# EAGLE design main (EAGLE 9.6.2)
CNAME: ZDS Shifter Pro; CREVISION: F; DESIGNER: Darin Kadrioski
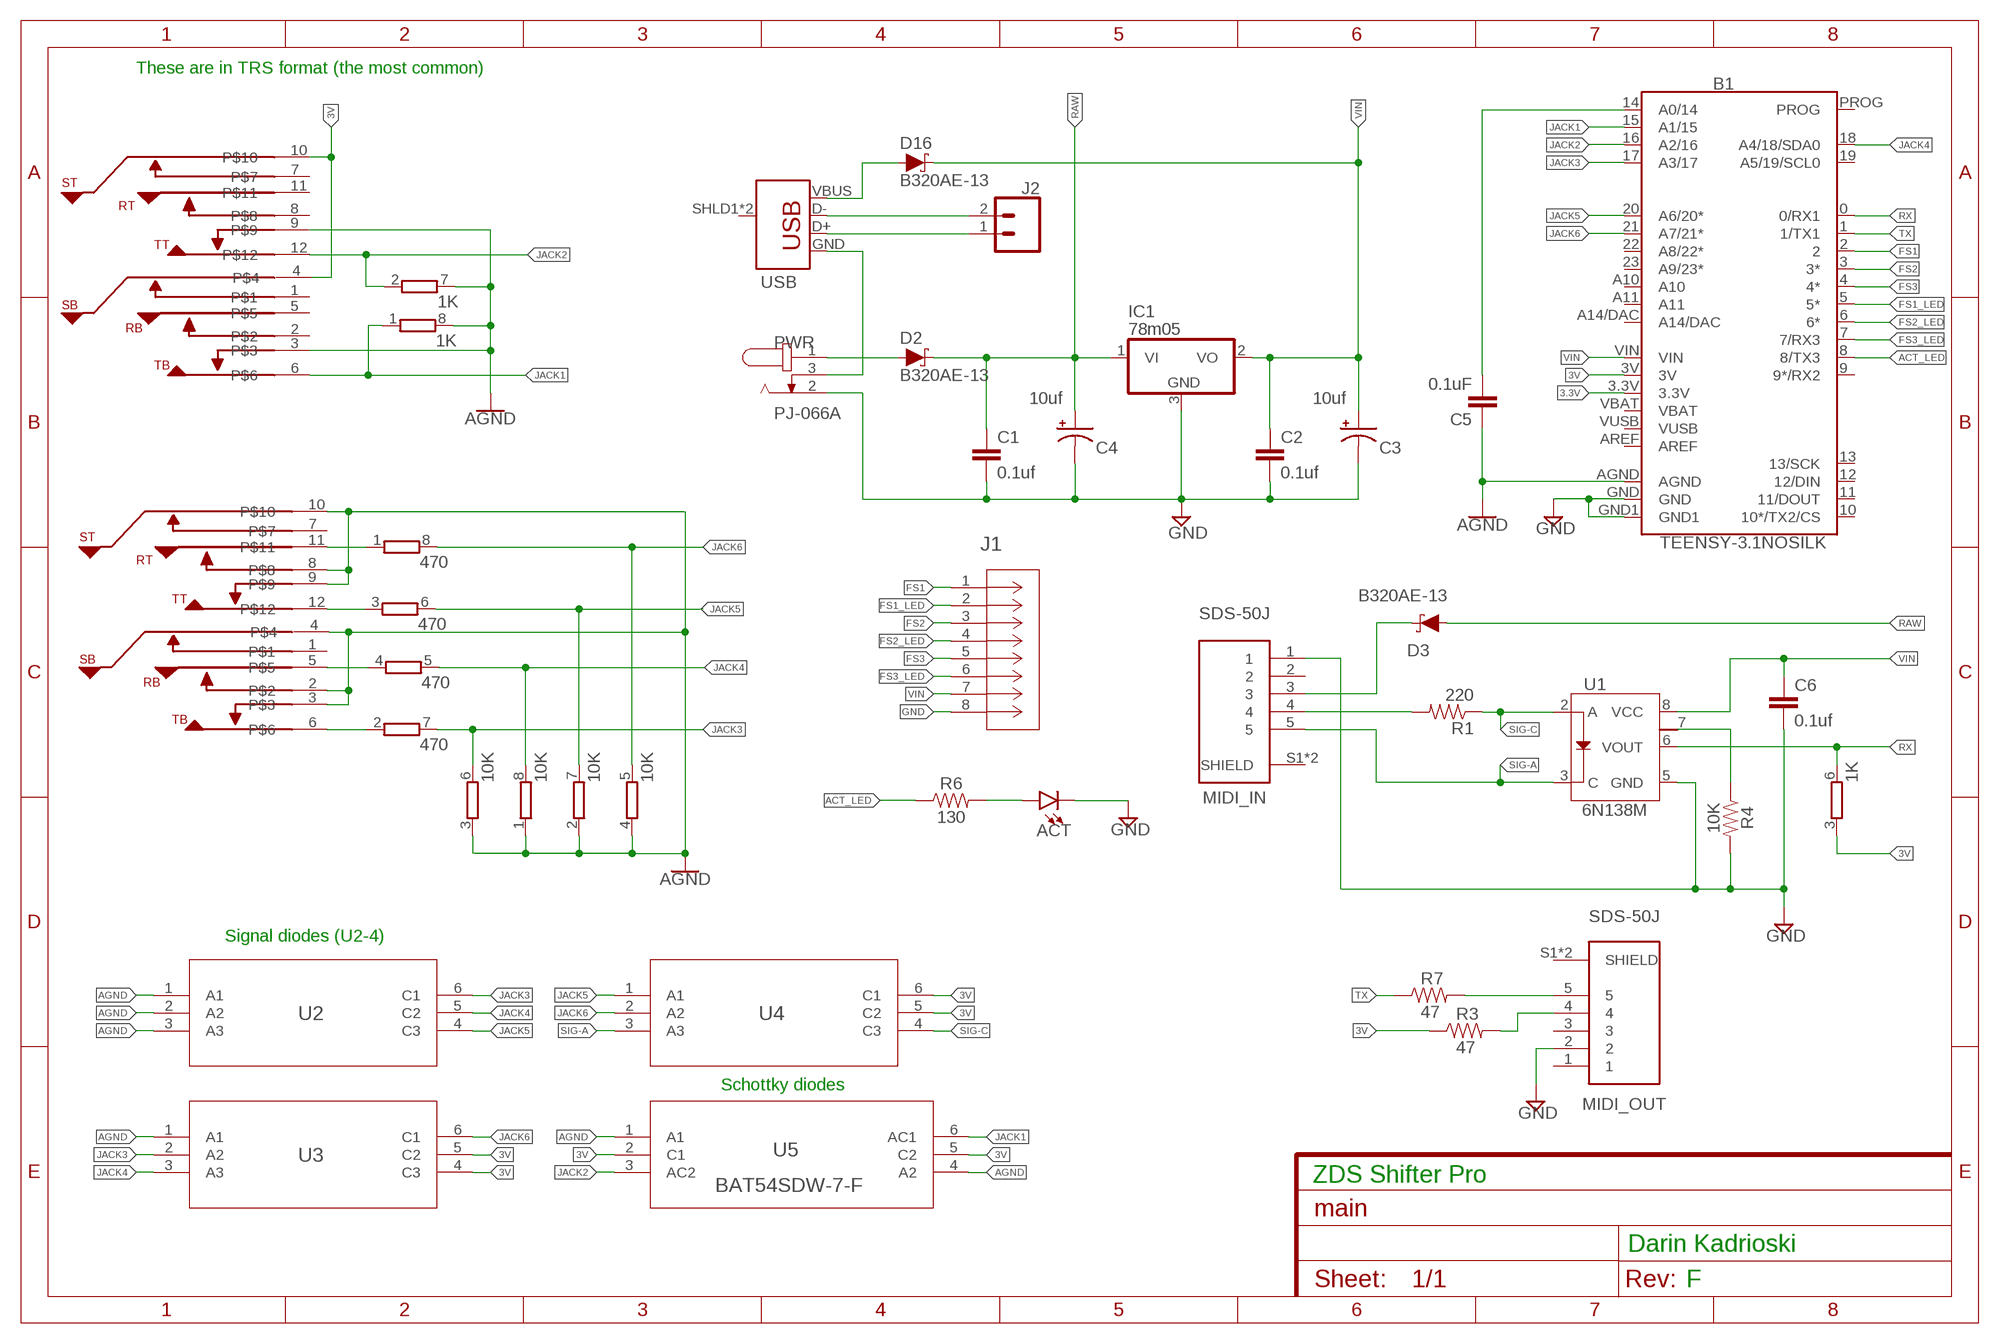
[diagram p0: schematic, sheet 1]

## Parts
ACT  LED3MM  [LED_3MM]
B1  TEENSY-3.1NOSILK  [TEENSY-3.1_NOSILK]
C1  0.1uf  C-EUC1206  [C1206]
C2  0.1uf  C-EUC1206  [C1206]
C3  10uf  47UF-POLAR-PANASONIC_D-35V-20%  [PANASONIC_D]
C4  10uf  47UF-POLAR-PANASONIC_D-35V-20%  [PANASONIC_D]
C5  0.1uF  C-EUC1206  [C1206]
C6  0.1uf  C-EUC1206  [C1206]
D2  B320AE-13  DIODE-SCHOTTKY-SS14  [SMA-DIODE]
D3  B320AE-13  DIODE-SCHOTTKY-SS14  [SMA-DIODE]
D16  B320AE-13  DIODE-SCHOTTKY-SS14  [SMA-DIODE]
EXP  EXP  ACJS-MHDCM  [MHD]
IC1  78m05  7805DT  [TO252]
J1  188275-8  [CONN_188275-8_TYC]
J2  CONN_02  [1X02]
MIDI_IN  SDS-50J  [CUI_SDS-50J]
MIDI_OUT  SDS-50J  [CUI_SDS-50J]
PWR  PJ-066A  [CUI_PJ-066A]
R1  220  RESISTOR1206  [1206]
R3  47  RESISTOR1206  [1206]
R4  10K  RESISTOR1206  [1206]
R6  130  RESISTOR1206  [1206]
R7  47  RESISTOR1206  [1206]
RN1  470  4R-NEXB38V  [EXB38V]
RN2  10K  4R-NEXB38V  [EXB38V]
RN3  1K  4R-NEXB38V  [EXB38V]
TRIG1  TRIG  ACJS-MHDCM  [MHD]
U1  6N138M  OPTO_DARL_6N138S  [8-SMD]
U2  MMBD4148TW-7-F  [SOT-363_DIO]
U3  MMBD4148TW-7-F  [SOT-363_DIO]
U4  MMBD4148TW-7-F  [SOT-363_DIO]
U5  BAT54SDW-7-F  [SOT-363_DIO]
USB  USB_B_PTH  [USB-B-PTH]

## Nets
3.3V: B1.3.3V
3V [VCC]: B1.3V EXP.4 EXP.10 R3.1 RN3.3 U3.4(C3) U3.5(C2) U4.5(C2) U4.6(C1) U5.2(C1) U5.5(C2)
ACT_LED: B1.8(8/TX3) R6.1
AGND: B1.AGND C5.1 EXP.3 EXP.9 RN2.1 RN2.2 RN2.3 RN2.4 RN3.7 RN3.8 TRIG1.2 TRIG1.3 TRIG1.4 TRIG1.8 TRIG1.9 TRIG1.10 U2.1(A1) U2.2(A2) U2.3(A3) U3.1(A1) U5.1(A1) U5.4(A2)
FS1: B1.2 J1.1
FS1_LED: B1.5(5*) J1.2
FS2: B1.3(3*) J1.3
FS2_LED: B1.6(6*) J1.4
FS3: B1.4(4*) J1.5
FS3_LED: B1.7(7/RX3) J1.6
GND [GND]: ACT.K(C) B1.GND B1.GND1 C1.2 C2.2 C3.- C4.- C6.2 IC1.3(GND) J1.8 MIDI_IN.1 MIDI_OUT.2 PWR.2 R4.2 U1.5(GND)
J3-TIP: RN1.2 TRIG1.6
J4-RING: RN1.4 TRIG1.5
J5-TIP: RN1.3 TRIG1.12
J6-RING: RN1.1 TRIG1.11
JACK1: B1.15(A1/15) EXP.6 RN3.1 U5.6(AC1)
JACK2: B1.16(A2/16) EXP.12 RN3.2 U5.3(AC2)
JACK3: B1.17(A3/17) RN1.7 RN2.6 U2.6(C1) U3.2(A2)
JACK4: B1.18(A4/18/SDA0) RN1.5 RN2.8 U2.5(C2) U3.3(A3)
JACK5: B1.20(A6/20*) RN1.6 RN2.7 U2.4(C3) U4.1(A1)
JACK6: B1.21(A7/21*) RN1.8 RN2.5 U3.6(C1) U4.2(A2)
N$1: ACT.A R6.2
N$3: MIDI_IN.4 R1.2
N$4: B1.14(A0/14) C5.2
N$5 [RAW]: D3.C MIDI_IN.3
N$6: MIDI_OUT.4 R3.2
N$7 [RAW]: D2.A PWR.1
N$8: MIDI_OUT.5 R7.2
N$10: J2.1 USB.D+
N$11: R4.1 U1.7
N$13: J2.2 USB.D-
N$15: PWR.3 USB.GND
N$17: D16.A USB.VBUS
RAW [RAW]: C1.1 C4.+ D2.C D3.A IC1.1(VI)
RX: B1.0(0/RX1) RN3.6 U1.6(VOUT)
SIG-A: MIDI_IN.5 U1.3(C) U4.3(A3)
SIG-C: R1.1 U1.2(A) U4.4(C3)
TX: B1.1(1/TX1) R7.1
VIN: B1.VIN C2.1 C3.+ C6.1 D16.C IC1.2(VO) J1.7 U1.8(VCC)
Unconnected: B1.9(9*/RX2) B1.10(10*/TX2/CS) B1.11(11/DOUT) B1.12(12/DIN) B1.13(13/SCK) B1.19(A5/19/SCL0) B1.22(A8/22*) B1.23(A9/23*) B1.A10 B1.A11 B1.A14/DAC B1.AREF B1.PROG EXP.1 EXP.2 EXP.5 EXP.7 EXP.8 EXP.11 MIDI_IN.2 MIDI_IN.S1(SHIELD) MIDI_IN.S2(SHIELD) MIDI_OUT.1 MIDI_OUT.3 MIDI_OUT.S1(SHIELD) MIDI_OUT.S2(SHIELD) RN3.4 RN3.5 TRIG1.1 TRIG1.7 USB.SHLD1(SHIELD) USB.SHLD2(SHIELD)

## Notes on the sheet
- These are in TRS format (the most common)
- Signal diodes (U2-4)
- Schottky diodes

## Power pins joined to a net without a drawn wire
VBAT: B1.VBAT
VUSB: B1.VUSB

## Library data of the parts
ACT = SparkFun-LED:LED: LED (Generic) Standard schematic elements and footprints for 5mm, 3mm, 1206, and 0603 sized LEDs. Generic LEDs with no color specified.; PROD_ID: DIO-08794
B1 = SparkFun-Boards:TEENSY-3.1: Teensy 3+ Footprint Mechanical footprint with connectors for Teensy Development Board with ARM Cortex. SparkFun Products: Teensy 3.2 <https://www.sparkfun.com/products/13736> Teensy LC <https://www.sparkfun.com/products/13305>; SF_ID: DEV-12646
C1 C2 C5 C6 = resistor:C-EU: CAPACITOR, European symbol
C3 C4 = SparkFun-Capacitors:47UF-POLAR: 47µF polarized capacitors A capacitor is a passive two-terminal electrical component used to store electrical energy temporarily in an electric field.; PROD_ID: CAP-08478; VALUE: 47uF
D2 D3 D16 = SparkFun-DiscreteSemi:DIODE-SCHOTTKY: Schottky diode A Schottky diode is a semiconductor diode which has a low forward voltage drop and a very fast switching action.; PROD_ID: DIO-08053; VALUE: 1A/40V/500mV
EXP TRIG1 = ACJS-MHDCM:ACJS-MHDCM: Check prices <https://pricing.snapeda.com/search/part/ACJS-MHDCM/?ref=eda>; AVAILABILITY: Warning; DESCRIPTION: 6.35mm (0.250, 1/4) - Headphone Phone Jack, Dual Stereo (3 Conductor, TRS) Connector Press-Fit, Solder; MF: Amphenol; MP: ACJS-MHDCM; PACKAGE: None; PRICE: None; PURCHASE-URL: https://pricing.snapeda.com/search/part/ACJS-MHDCM/?ref=eda
IC1 = linear:78*: Positive VOLTAGE REGULATOR Source: http://cache.national.com/ds/LM/LM78L05.pdf http://www.fairchildsemi.com/ds/LM/LM7805.pdf
J1 = ul_1882758:188275-8; BUILT_BY: EMA_UL_Team; COPYRIGHT: Copyright (C) 2016 Accelerated Designs. All rights reserved; MANUFACTURER_PART_NUMBER: 188275-8; SOURCELIBRARY: Tyco_2012-06-25; VENDOR: TE Connectivity
J2 = SparkFun-Connectors:CONN_02: Multi connection point. Often used as Generic Header-pin footprint for 0.1 inch spaced/style header connections On any of the 0.1 inch spaced packages, you can populate with these: Break Away Headers - Straight <https://www.sparkfun.com/products/116> (PRT-00116) Break Away Male Headers - Right Angle <https://www.sparkfun.com/products/553> (PRT-00553) Female Headers <https://www.sparkfun.com/products/115> (PRT-00115) Break Away Headers - Machine Pin <https://www.sparkfun.com/products/117> (PRT-00117) Break Away Female Headers - Swiss Machine Pin <https://www.sparkfun.com/products/743> (PRT-00743) For SCREWTERMINALS and SPRING TERMINALS visit here: Screw Terimnals on SparkFun.com <https://www.sparkfun.com/search/results?term=Screw+Terminals> (5mm/3.5mm/2.54mm spacing) This device is also useful as a general connection point to wire up your design to another part of your project. Our various solder wires solder well into these plated through hole pads. Hook-Up Wire - Assortment (Stranded, 22 AWG) <https://www.sparkfun.com/products/11375> (PRT-11375) Hook-Up Wire - Assortment (Solid Core, 22 AWG) <https://www.sparkfun.com/products/11367> (PRT-11367) View the entire wire category on our website here <https://www.sparkfun.com/categories/141> Special notes: Molex polarized connector foot print use with: PRT-08233 with associated crimp pins and housings. 2.54_SCREWTERM for use with PRT-10571. 3.5mm Screw Terminal footprints for PRT-08084 5mm Screw Terminal footprints for use with PRT-08432
MIDI_IN MIDI_OUT = SDS-50J:SDS-50J: Standard Din Connector 5 Pin, Right-Angle Receptacle, 180° Check prices <https://snapeda.com/parts/SDS-50J/CUI%20Devices/view-part/?ref=eda>; AVAILABILITY: Warning; CUI_PURCHASE_URL: https://www.cuidevices.com/product/interconnect/connectors/din-connectors/sds-j-series?utm_source=snapeda.com&utm_medium=referral&utm_campaign=snapedaBOM; DESCRIPTION: 3~13 Positions, Receptacle, Right Angle, Through Hole, Standard Circular DIN Connector; DIGIKEY-PURCHASE-URL: https://snapeda.com/shop?store=DigiKey&id=422204; MF: CUI Devices; MOUSER-PURCHASE-URL: https://snapeda.com/shop?store=Mouser&id=422204; MP: SDS-50J; PACKAGE: None; PRICE: None
PWR = PJ-066A:PJ-066A: 24 VDC 5 A Right Angle Through Hole 2 Conductors 3 Contacts Male Power Jack; CUI_PURCHASE_URL: https://www.cui.com/product/interconnect/dc-power-connectors/jacks/2.0-mm-center-pin/pj-066a?utm_source=snapeda.com&utm_medium=referral&utm_campaign=snapedaBOM; DESCRIPTION: 24 VDC 5 A Right Angle Through Hole 2 Conductors 3 Contacts Male Power Jack; DIGI-KEY_PART_NUMBER: CP-066A-ND; DIGI-KEY_PURCHASE_URL: https://www.digikey.com/product-detail/en/cui-inc/PJ-066A/CP-066A-ND/2627225?utm_source=snapeda&utm_medium=aggregator&utm_campaign=symbol; MF: CUI Inc.; MP: PJ-066A; PACKAGE: None
R1 R3 R4 R6 R7 = SparkFun-Resistors:RESISTOR: Generic Resistor Package
RN1-RN3 = resistor-dil:4R-N: Array Chip Resistor Source: RS Component / Phycomp; OC_FARNELL: unknown; OC_NEWARK: unknown
U1 = darin-custom:OPTO_DARL_6N138S: Optoisolator, darlington pair output Optocoupler consisting of an AlGaAs LED optically coupled to a high gain split darlington photodetector. SparkFun Products: SparkFun MIDI Shield <https://www.sparkfun.com/products/12898>; PROD_ID: IC-09482
U2-U4 = MMBD4148TW7F:MMBD4148TW-7-F; BUILT_BY: EMA_UL_Team; MANUFACTURER_PART_NUMBER: MMBD4148TW-7-F; SOURCELIBRARY: DIODESINC_2_2015-08-18; VENDOR: Diodes Inc
U5 = BAT54SDW7F:BAT54SDW-7-F; BUILT_BY: EMA_UL_Team; MANUFACTURER_PART_NUMBER: BAT54SDW-7-F; SOURCELIBRARY: DIODESINC_2_2015-08-18; VENDOR: Diodes Inc
USB = SparkFun-Connectors:USB_B: USB Type B Connector SparkFun Products: SparkFun Stepoko <https://www.sparkfun.com/products/13899> PTH; PROD_ID: CONN-08278; SF_ID: PRT-00139

## Net classes
0 default: width 0.254 mm
1 VCC: width 0.254 mm
2 GND: width 0.254 mm
3 RAW: width 0.6 mm

## Board
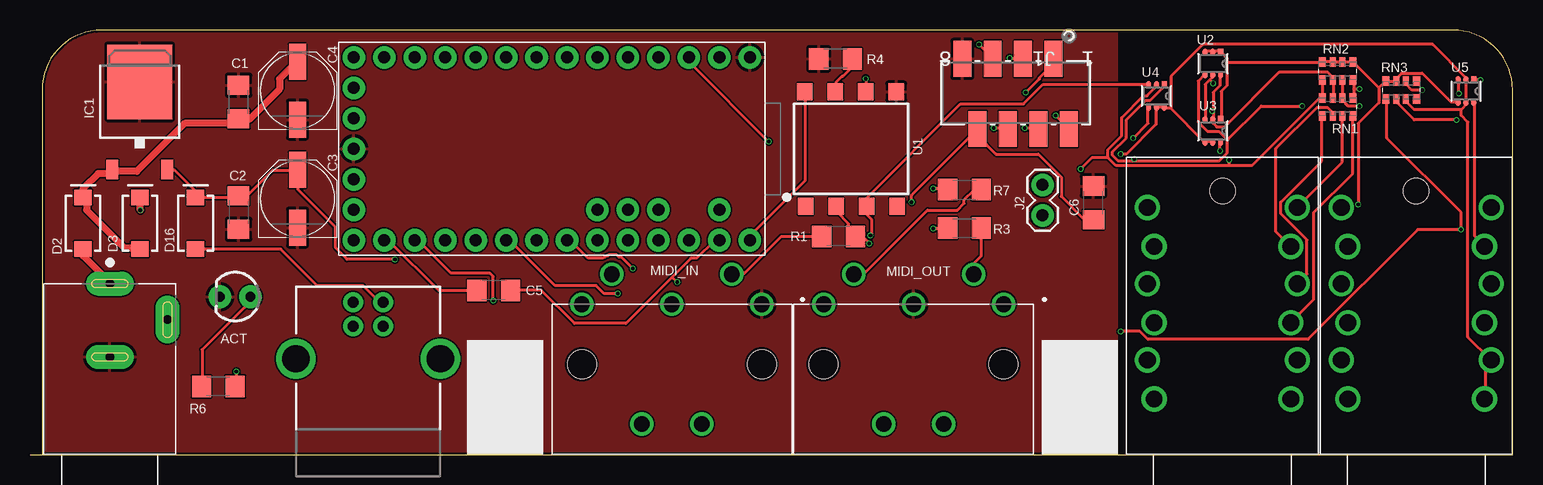
[diagram p1: board, top side]
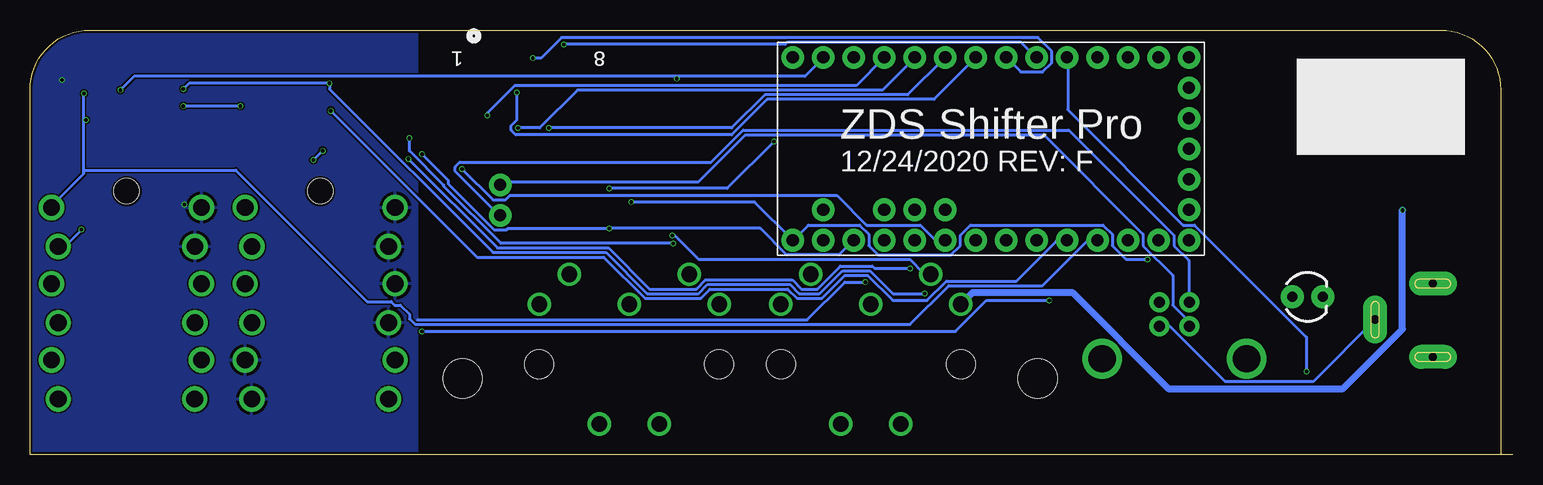
[diagram p2: board, bottom side, seen from below]

Size 123.6 x 35.4 mm. Coordinates in mm from the lower left corner, seen from the top.
Outline: 0,0 1,0
Outline: 1,0 123.6,0 123.6,30.4 arc90 118.6,35.4 6,35.4 arc90 1,30.4 1,0
Copper layers (1*16): Top 0.035559375mm / dielectric 1.6mm / Bottom 0.035559375mm
Design rules "jlcpcb2layer": minimum track width 5mil, minimum drill 12mil, track to track 5mil, track to pad 5mil, pad to pad 5mil, via to via 5mil, smd to smd 5mil, copper to edge 8mil, drill to drill 6mil, minimum pad ring 5mil, minimum via ring 3mil, stop-mask expansion 2.5mil, vias tented up to drill 0mil, thermal gap 10mil
Holes 3.25 mm at 87.53,6.35 39.6,6.35

### Footprints (pad centres in the part's own frame; a part is rotated, then mirrored left to right if it is on the bottom)
LED_3MM = drill 0.813 pad 1.88: A -1.27,0; K 1.27,0
TEENSY-3.1_NOSILK = drill 1.016 pad 1.88: 0 7.62,-13.97; 1 7.62,-11.43; 2 7.62,-8.89; 3 7.62,-6.35; 3.3V 2.54,16.51; 3V -7.62,-11.43; 4 7.62,-3.81; 5 7.62,-1.27; 6 7.62,1.27; 7 7.62,3.81; 8 7.62,6.35; 9 7.62,8.89; 10 7.62,11.43; 11 7.62,13.97; 12 7.62,16.51; 13 -7.62,16.51; 14 -7.62,13.97; 15 -7.62,11.43; 16 -7.62,8.89; 17 -7.62,6.35; 18 -7.62,3.81; 19 -7.62,1.27; 20 -7.62,-1.27; 21 -7.62,-3.81; 22 -7.62,-6.35; 23 -7.62,-8.89; A10 -5.08,-6.35; A11 -5.08,-3.81; A14/DAC -5.08,16.51; AGND -7.62,-13.97; AREF -5.08,-8.89; GND 0,16.51; GND1 7.62,-16.51; PROG -2.54,16.51; VBAT 5.08,16.51; VIN -7.62,-16.51; VUSB -5.08,-13.97
C1206 = smd 1.6 x 1.8: 1 -1.4,0; 2 1.4,0
PANASONIC_D = smd 3 x 1.4: + 2.4,0; - -2.4,0
SMA-DIODE = smd 1.27 x 1.47: A -2.15,0; C 2.15,0
MHD = drill 1.4: 1 3.65,-5.69; 2 -2.7,-5.7; 3 -9.05,-5.7; 4 3.65,5.7; 5 -2.7,5.7; 6 -9.05,5.7; 7 0.4,-6.25; 8 -5.95,-6.25; 9 -12.3,-6.25; 10 0.4,6.25; 11 -5.95,6.25; 12 -12.3,6.25 | hole 2.1: -13.68,0
TO252 = smd 1 x 1.6: 1 -2.28,-4.8; 2 2.28,-4.8 | smd 5.4 x 6.2: 3 0,2.5
CONN_188275-8_TYC = smd 1.499 x 2.997: 1 0,5.85; 2 1.27,0; 3 2.54,5.85; 4 3.81,0; 5 5.08,5.85; 6 6.35,0; 7 7.62,5.85; 8 8.89,0
1X02 = drill 1.016 pad 1.88: 1 0,0; 2 2.54,0
CUI_SDS-50J = drill 1.3: 1 7.5,0; 2 0,0; 3 -7.5,0; 4 5,2.5; 5 -5,2.5; S1 -2.5,-10; S2 2.5,-10 | hole 2.4: -7.5,-5; 7.5,-5
CUI_PJ-066A = drill 0.7 pad 2 long: 1 0,0; 2 6.1,0; 3 3,4.8
1206 = smd 1.6 x 1.8: 1 -1.4,0; 2 1.4,0
EXB38V = smd 0.6 x 0.8: 1 -1.275,-0.75; 4 1.275,-0.75; 5 1.275,0.75; 8 -1.275,0.75 | smd 0.5 x 0.8: 2 -0.4,-0.75; 3 0.4,-0.75; 6 0.4,0.75; 7 -0.4,0.75
8-SMD = smd 1.3 x 1.4: 1 -3.96,-4.96; 2 -1.42,-4.96; 3 1.12,-4.96; 4 3.66,-4.96; 5 3.59,4.58; 6 1.05,4.58; 7 -1.49,4.58; 8 -4.03,4.58
SOT-363_DIO = smd 0.6 x 0.42: 1 -0.95,0.65; 2 -0.95,0; 3 -0.95,-0.65; 4 0.95,-0.65; 5 0.95,0; 6 0.95,0.65
USB-B-PTH = drill 0.914 pad 1.676: D+ 4,1.25; D- 5.981,1.25; GND 4,-1.25; VBUS 5.981,-1.25 | drill 2.286: SHLD1 1.282,-6.02; SHLD2 1.282,6.02

### Placement (x,y rotation side)
ACT  17.1,13.17 180 top
B1  43.5,25.5 90 top
C1  17.38,29.4 90 top
C2  17.38,20.2 270 top
C3  22.3,21.34 90 top
C4  22.3,30.34 90 top
C5  38.65,13.7 180 top
C6  88.65,21 90 top
D2  4.42,19.3 90 top
D3  9.17,19.3 90 top
D16  13.8,19.3 90 top
EXP  115.55,8.3 270 top
IC1  9.15,28.58 0 top
J1  86.6,33 180 top
J2  84.4,22.5 270 top
MIDI_IN  53.5,12.55 0 top
MIDI_OUT  73.65,12.55 0 top
PWR  6.66,14.26 270 top
R1  67.4,18.2 180 top
R3  77.9,18.9 0 top
R4  67.15,33 180 top
R6  15.7,5.69 180 top
R7  77.9,22.1 0 top
RN1  109,29 0 top
RN2  109,32 180 top
RN3  114.3,30.4 0 top
TRIG1  99.4,8.3 270 top
U1  68.62,25.68 0 top
U2  98.6,32.6 270 top
U3  98.6,27 270 top
U4  93.9,29.9 270 top
U5  119.7,30.3 270 top
USB  28.2,6.72 90 top

### Tracks (layer width: path | path; a pad name or v marks a point on that pad's centre or on a via)
3V  (via drill 0.3)
  Top 0.254: v75.3,18.86 76.44,18.86 R3.1 | U3.5 98.54,26.1 97.97,26.1 U3.4 97.87,26.1 95.11,28.86 | 95.11,28.86 94.63,28.86 U4.6 94.53,28.96 93.96,28.96 U4.5 93.87,28.86 93.87,27.53 91.39,25.05 v90.92,25.05 | 119.3,28.77 115.39,28.77 114.73,29.43 114.73,29.62 RN3.3 | 119.3,28.77 119.78,29.24 U5.5 119.68,29.43 119.68,31.24 U5.2 119.78,31.34 116.92,34.2 97.77,34.2 95.11,31.53 95.11,28.86 | 119.3,28.77 119.3,28.29 119.87,27.72 119.87,9.81 121.78,7.91 EXP.10 121.78,7.81 121.3,7.33 121.3,4.67 EXP.4
  Bottom 0.254: B1.3V 55.01,17.81 56.15,16.67 60.53,16.67 62.72,18.86 v75.3,18.86 83.77,18.86 83.87,18.76 84.92,18.76 88.72,22.57 88.72,22.86 v90.92,25.05
ACT_LED  (via drill 0.3)
  Top 0.254: v17.19,6.95 17.19,5.71 R6.1
  Bottom 0.254: v17.19,6.95 17.19,9.81 26.53,19.14 27.48,19.14 37.1,28.77 37.1,33.05 B1.8
AGND  (via drill 0.3)
  Top 0.254: 53.53,14.81 55.1,16.38 55.58,16.38 57.01,17.81 57.39,17.81 B1.AGND | 53.53,14.81 49.67,10.95 45.39,10.95 42.62,13.72 40.05,13.72 C5.1 | U5.4 119.02,29.43 118.44,29.43 116.06,31.81 114.35,31.81 113.97,31.43 113.97,31.24 RN3.7 113.78,31.15 113.11,31.15 RN3.8 112.44,30.57 | U2.3 97.97,33.62 98.54,33.62 U2.2 98.63,33.62 99.2,33.62 U2.1 99.3,33.53 99.77,33.05 99.77,32.67 | 99.77,32.67 99.77,30.77 99.3,30.29 99.3,28 U3.1 | v120.92,31.24 120.44,31.24 U5.1 | v110.73,20.86 110.73,27.62 112.44,29.34 112.44,30.57 | 112.44,30.57 110.35,32.67 RN2.1 110.25,32.77 109.49,32.77 RN2.2 109.39,32.77 108.73,32.77 RN2.3 108.54,32.77 107.78,32.77 RN2.4 107.68,32.67 99.77,32.67 | v53.96,14.38 53.53,14.81
  Bottom 0.254: v53.96,14.38 55.67,14.38 58.82,11.24 91.3,11.24
  pour Bottom: 91.3,37 124,37 124,-1 91.3,-1
FS1  (via drill 0.3)
  Top 0.254: v85.49,28.29 86.53,27.24 J1.1
  Bottom 0.254: v85.49,28.29 85.49,28.48 83.2,30.77 54.72,30.77 52.44,33.05 B1.2
FS1_LED  (via drill 0.3)
  Top 0.254: v83.01,30.19 84.15,31.34 84.15,31.43 85.3,32.58 85.3,32.96 J1.2
  Bottom 0.254: v83.01,30.19 83.01,27.91 83.49,27.43 83.49,27.05 83.11,26.67 65.1,26.67 62.15,29.62 48.24,29.62 44.81,33.05 B1.5
FS2  (via drill 0.3)
  Top 0.254: v82.92,27.24 84.06,27.24 J1.3
  Bottom 0.254: v82.92,27.24 81.11,27.24 77.96,30.39 52.53,30.39 49.86,33.05 B1.3
FS2_LED  (via drill 0.3)
  Top 0.254: v81.68,33.05 82.72,33.05 J1.4
  Bottom 0.254: v81.68,33.05 81.01,33.05 79.3,34.77 39.58,34.77 38.43,33.62 38.43,32.67 39.2,31.91 41.01,31.91 42.15,33.05 B1.6
FS3  (via drill 0.3)
  Top 0.254: v80.34,27.24 81.49,27.24 J1.5
  Bottom 0.254: v80.34,27.24 65.1,27.24 62.34,30 50.44,30 47.39,33.05 B1.4
FS3_LED  (via drill 0.3)
  Top 0.254: v79.11,34.2 80.25,33.05 J1.6
  Bottom 0.254: v79.11,34.2 60.63,34.2 60.44,34.38 41.01,34.38 39.77,33.15 B1.7
GND
  pour Top: 0,37 90.6,37 90.6,-1 0,-1
J3-TIP
  Top 0.254: RN1.2 108.54,28.29 108.54,28.57 108.16,28.96 107.3,28.96 103.87,25.53 103.87,18.57 105.01,17.43 TRIG1.6
J4-RING
  Top 0.254: RN1.4 110.25,28.19 110.25,23.43 107.01,20.19 107.01,12.95 105.11,11.05 TRIG1.5
J5-TIP
  Top 0.254: RN1.3 109.39,28.19 109.39,24.38 105.68,20.67 TRIG1.12
J6-RING
  Top 0.254: RN1.1 107.68,28.19 107.68,24.48 104.25,21.05 104.25,20.1 106.44,17.91 106.44,15.05 105.68,14.29 TRIG1.11
JACK1  (via drill 0.3)
  Top 0.254: U5.6 120.44,29.34 120.44,18.19 121.21,17.43 EXP.6 | RN3.1 113.11,29.62 113.11,26.38 119.3,20.19 v119.3,18.76 115.68,18.76 106.54,9.62 93.2,9.62 92.53,10.29 v90.92,10.29 | v38.62,12.86 38.62,14.86 38.34,15.14 35.1,15.14 32.43,17.81 32.15,17.81 B1.15
  Bottom 0.254: v119.3,18.76 120.63,17.43 121.21,17.43 EXP.6 | v38.62,12.86 43.86,12.86 46.43,10.29 v90.92,10.29
JACK2  (via drill 0.3)
  Top 0.254: v119.11,30.1 119.11,31.24 U5.3 | v118.92,27.91 115.39,27.91 113.97,29.34 113.97,29.62 RN3.2
  Bottom 0.254: 119.11,23.72 119.11,23.43 121.87,20.67 EXP.12 | 119.11,23.72 119.11,27.91 | 119.11,27.91 v119.11,30.1 | v118.92,27.91 119.11,27.91 | 119.11,23.72 106.44,23.72 95.49,12.76 93.49,12.76 93.2,12.48 92.73,12.48 91.96,11.72 91.96,11.34 91.49,10.86 50.24,10.86 47.01,14.1 39.2,14.1 35.48,17.81 34.62,17.81 B1.16
JACK3  (via drill 0.3)
  Top 0.254: RN1.7 108.63,29.81 108.63,31.24 RN2.6 108.54,31.34 108.54,31.53 108.16,31.91 104.16,31.91 99.58,27.34 98.92,27.34 98.63,27.62 98.63,27.91 U3.2 98.63,28 98.63,28.67 | 98.63,28.67 98.63,30.19 99.2,30.77 99.2,31.62 U2.6 | v98.54,28.67 98.63,28.67
  Bottom 0.254: v98.54,28.67 86.34,16.48 75.77,16.48 72.34,13.05 67.67,13.05 66.91,13.81 60.44,13.81 59.67,13.05 57.58,13.05 55.67,14.95 53.77,14.95 51.67,12.86 48.82,12.86 47.2,14.48 41.39,14.48 38.05,17.81 37.2,17.81 B1.17
JACK4  (via drill 0.3)
  Top 0.254: 110.35,30.48 110.35,31.24 RN2.8 | 110.35,30.48 110.35,29.81 RN1.5 | 98.35,31.24 98.54,31.43 98.54,31.62 U2.5 | 98.35,31.24 97.97,30.86 97.97,28 U3.3 | v110.82,30.48 110.35,30.48 | 98.35,31.24 v98.63,30.96 | v49.01,13.43 47.86,13.43 47.2,14.1 43.77,14.1 40.05,17.81 39.77,17.81 B1.18
  Bottom 0.254: v110.82,30.48 110.35,30.96 v98.63,30.96 98.63,30.48 85.01,16.86 75.58,16.86 72.15,13.43 67.86,13.43 67.1,14.19 60.24,14.19 59.48,13.43 57.77,13.43 55.86,15.34 53.58,15.34 51.67,13.43 v49.01,13.43
JACK5  (via drill 0.3)
  Top 0.254: RN2.7 109.39,29.81 RN1.6 109.39,29.62 109.68,29.34 109.68,29.24 109.87,29.05 v110.82,29.05 | 92.06,24.48 99.11,24.48 99.77,25.15 99.77,26.29 | 92.06,24.48 90.72,24.48 90.25,24.96 90.25,25.24 91.39,26.38 91.39,27.91 93.01,29.53 93.39,29.53 94.53,30.67 94.53,30.77 U4.1 | 99.77,26.29 99.11,26.96 98.16,26.96 97.39,27.72 97.39,31.15 97.87,31.62 U2.4 | v106.06,29.05 102.63,29.05 99.87,26.29 99.77,26.29 | v50.24,15.53 49.29,16.48 49.1,16.48 48.91,16.67 48.24,16.67 48.15,16.57 48.05,16.57 47.96,16.48 47.86,16.48 47.77,16.38 46.53,16.38 45.1,17.81 44.81,17.81 B1.20 | v92.06,24.67 92.06,24.48
  Bottom 0.254: v106.06,29.05 v110.82,29.05 | v50.24,15.53 53.2,15.53 53.39,15.72 56.05,15.72 57.96,13.81 59.29,13.81 60.05,14.57 67.29,14.57 68.06,13.81 71.96,13.81 75.39,17.24 84.63,17.24 v92.06,24.67
JACK6  (via drill 0.3)
  Top 0.254: 89.87,24.77 89.87,25.43 91.01,26.57 91.01,28.1 92.82,29.91 93.11,29.91 93.87,30.67 93.87,30.77 U4.2 | 89.87,24.77 90.53,24.1 99.97,24.1 | 99.97,24.1 101.87,24.1 107.49,29.72 107.68,29.72 RN1.8 107.78,29.81 107.78,31.24 RN2.5 | v99.2,25.34 99.2,26 U3.6 | 99.97,24.1 v99.97,24.57 | v87.58,23.81 88.53,24.77 89.87,24.77
  Bottom 0.254: v99.97,24.57 v99.2,25.34 | v87.58,23.81 85.01,21.24 83.96,21.24 83.58,21.62 56.34,21.62 53.86,19.14 49.39,19.14 48.15,17.91 47.39,17.91 B1.21
N$1
  Top 0.254: R6.2 14.34,5.71 14.34,8.76 18.34,12.76 18.34,13.14 ACT.A
N$3
  Top 0.254: R1.2 65.96,18.19 62.63,18.19 59.58,15.14 59.48,15.14 59.39,15.05 58.53,15.05 MIDI_IN.4
N$4
  Top 0.254: C5.2 37.2,13.72 34.05,13.72 29.96,17.81 29.57,17.81 B1.14
N$5  (via drill 0.3)
  Top 0.6: v9.19,20.38 9.19,21.43 D3.C
  Bottom 0.6: v9.19,20.38 9.19,10.48 14.14,5.52 28.72,5.52 36.72,13.53 45.01,13.53 45.96,12.57 MIDI_IN.3
N$6
  Top 0.254: R3.2 79.3,18.86 79.3,16.57 78.63,15.91 78.63,15.14 MIDI_OUT.4
N$7
  Top 0.6: D2.A 4.43,16.57 6.71,14.29 PWR.1
N$8
  Top 0.254: R7.2 78.72,22.1 77.87,21.24 77.87,20.95 77.3,20.38 74.82,20.38 69.58,15.14 68.72,15.14 MIDI_OUT.5
N$10
  Bottom 0.254: USB.D+ 27,10.76 27,11.14 28.34,12.48 28.34,14.95 30.81,17.43 30.81,18.38 39.1,26.67 63.96,26.67 67.86,22.77 84.15,22.77 84.34,22.57 J2.1
N$11
  Top 0.254: U1.7 67.2,30.29 67.2,31.05 67.67,31.53 67.77,31.53 68.53,32.29 68.53,32.96 R4.1
N$13
  Bottom 0.254: USB.D- 27,12.76 27,16.19 28.24,17.43 28.24,18.29 37.01,27.05 64.15,27.05 66.82,24.38 87.77,24.38 88.15,24 88.15,23.62 84.44,19.91 J2.2
N$15
  Bottom 0.254: USB.GND 29.38,10.67 28.53,10.67 23.95,6.1 16.62,6.1 11.48,11.24 PWR.3
N$17
  Top 0.254: D16.A 13.86,17.14 20.91,17.14 23.95,14.1 27.77,14.1 29.1,12.76 29.38,12.76 USB.VBUS
RAW
  Top 0.6: D3.A 9.1,17.24 7.86,17.24 4.71,20.38 4.71,21.14 4.62,21.24 D2.C 4.43,21.53 4.43,22.19 5.67,23.43 6.62,23.43 6.91,23.72 IC1.1 7.19,23.62 8.91,23.62 12.91,27.62 16.81,27.62 17.1,27.91 C1.1 18.34,28 20.81,30.48 20.81,31.34 22.24,32.77 C4.+
RX  (via drill 0.3)
  Top 0.254: v116.06,30.39 115.2,30.39 114.73,30.86 114.73,31.15 RN3.6 | v69.67,31.34 69.67,30.29 U1.6
  Bottom 0.254: v116.06,30.39 114.92,31.53 69.67,31.53 | 69.67,31.53 59.01,31.53 57.48,33.05 B1.0 | v69.67,31.34 69.67,31.53
SIG-A  (via drill 0.3)
  Top 0.254: U4.3 93.2,30.86 84.44,30.86 82.82,29.24 77.58,29.24 69.67,21.34 69.67,20.77 U1.3 69.67,20.67 69.67,20.1 70.15,19.62 70.15,18.38 v70.06,18.29
  Bottom 0.254: v70.06,18.29 69.87,18.29 67.86,16.29 50.24,16.29 49.1,15.14 48.53,15.14 MIDI_IN.5
SIG-C  (via drill 0.3)
  Top 0.254: v91.96,26.38 93.2,27.62 93.2,28.86 U4.4 | v69.96,17.62 69.39,18.19 68.82,18.19 R1.1 68.72,18.29 68.25,18.76 68.25,19.24 67.29,20.19 67.29,20.67 U1.2
  Bottom 0.254: v91.96,26.38 91.96,25.34 89.11,22.48 89.11,22.38 84.34,17.62 v69.96,17.62
TX  (via drill 0.3)
  Top 0.254: v75.3,22.19 76.44,22.19 R7.1 | v61.58,26.1 55.01,32.67 55.01,33.05 B1.1
  Bottom 0.254: v75.3,22.19 65.48,22.19 v61.58,26.1
VIN  (via drill 0.3)
  Top 0.254: C6.1 88.63,19.62 87.87,19.62 85.96,21.53 85.96,23.15 84.06,25.05 80.53,25.05 79.01,26.57 79.01,27.15 J1.7 78.92,26.57 78.44,26.57 73.48,21.62 v73.48,21.05 | IC1.2 11.48,23.72 12.05,23.72 13.76,22 13.76,21.53 D16.C 13.86,21.43 17.19,21.43 17.29,21.53 C2.1 17.48,21.62 18.14,21.62 20.24,23.72 22.24,23.72 C3.+ 22.34,23.62 22.34,22.1 25.48,18.95 25.48,17.24 26.43,16.29 v30.43,16.29 | U1.8 64.63,30.19 64.63,22.86 60.05,18.29 60.05,17.91 B1.VIN
  Bottom 0.254: v30.43,16.29 32.24,16.29 33.38,17.43 33.38,18.38 34.15,19.14 45.2,19.14 46.05,18.29 46.05,17.43 46.81,16.67 52.91,16.67 53.67,17.43 53.67,18.38 54.44,19.14 58.72,19.14 59.96,17.91 B1.VIN 60.05,17.91 63.2,21.05 v73.48,21.05

### Text on the board
bPlace: ZDS Shifter Pro | 12/24/2020 REV: F
tValues: TRIG | EXP